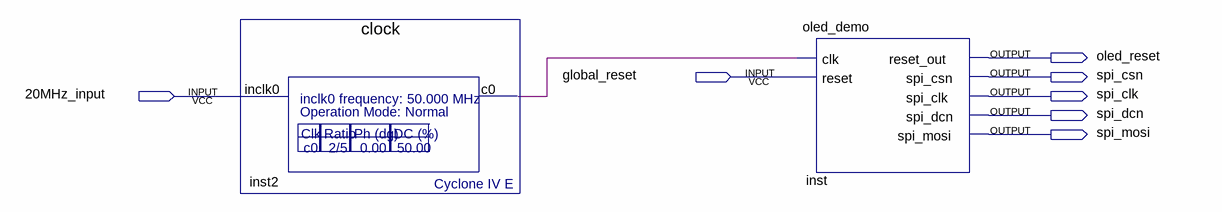
[diagram p0: schematic sheet]
// Quartus schematic demo_1.bdf as structural Verilog: 2 symbols, 7 pins
module demo_1 (
  input  global_reset,
  input  \20MHz_input ,
  output oled_reset,
  output spi_csn,
  output spi_clk,
  output spi_dcn,
  output spi_mosi
);

  wire inst2_c0;

  clock inst2 (.inclk0(\20MHz_input ), .c0(inst2_c0));
  oled_demo inst (
    .clk(inst2_c0), .reset(global_reset), .reset_out(oled_reset), .spi_csn(spi_csn), .spi_clk(spi_clk),
    .spi_dcn(spi_dcn), .spi_mosi(spi_mosi));
endmodule
